# Altium schematic sheet Sheet1.SchDoc
size A3
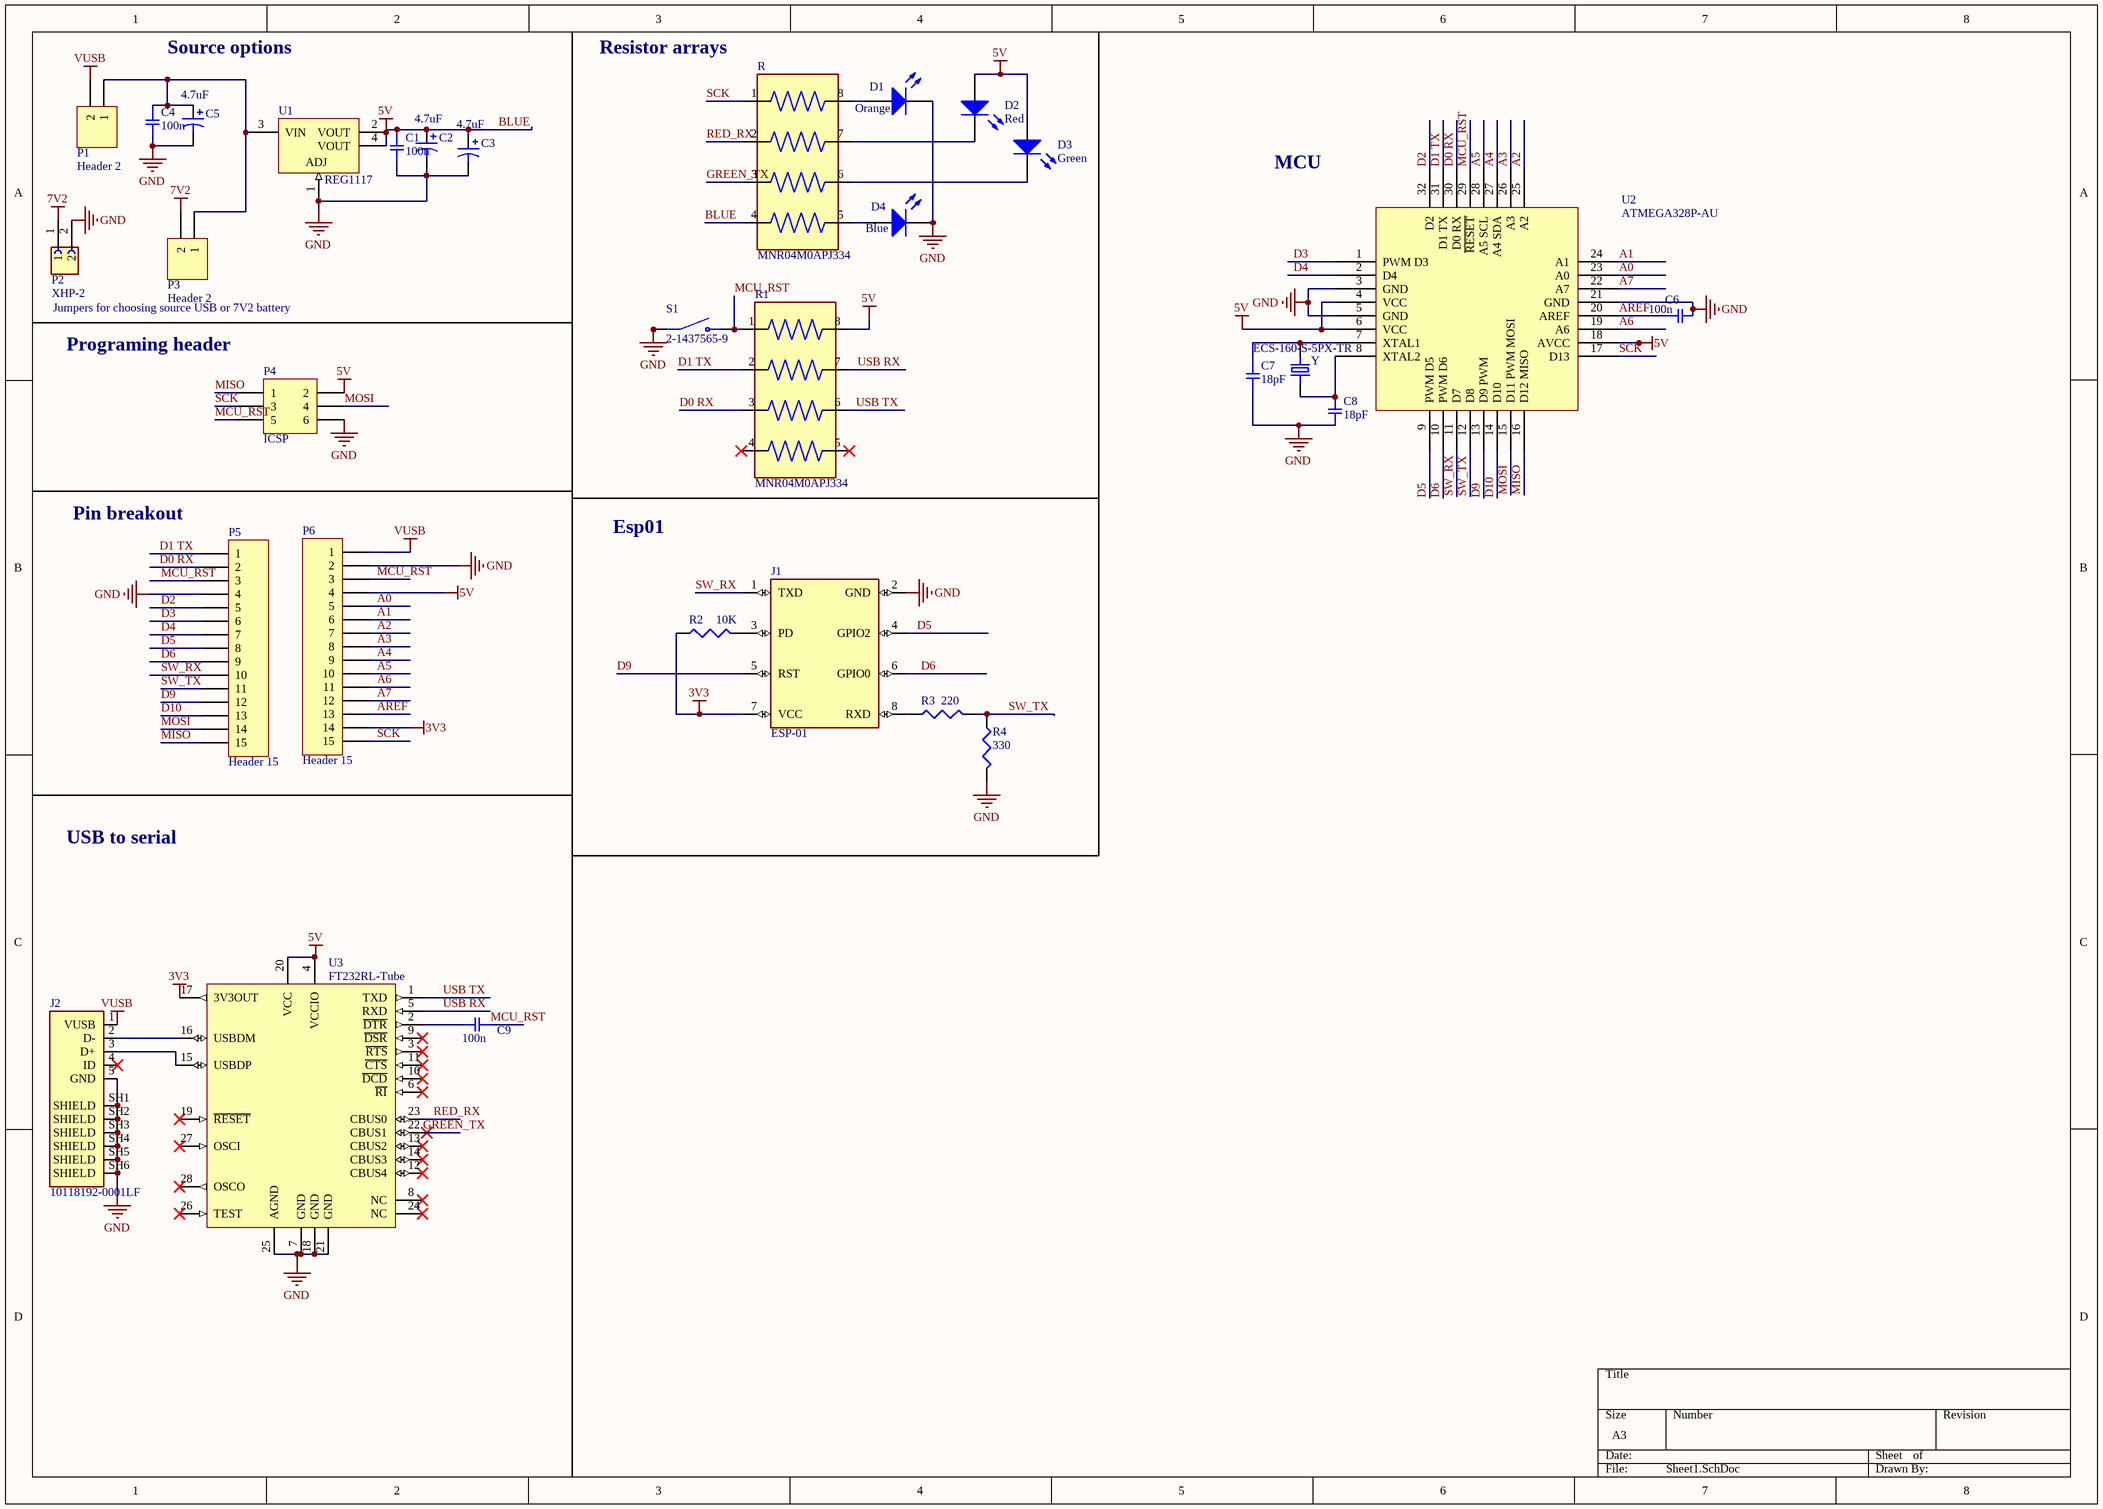
[diagram p0: Sheet1.SchDoc]

## Parts
C1  100n  [SMD-0805C]
C2  value 4.7uF  [49BC-E]  (hidden comment: 49BC475B010M)
C3  value 4.7uF  [49BC-E]  (hidden comment: 49BC475B010M)
C4  100n  [SMD-0805C]
C5  value 4.7uF  [49BC-E]  (hidden comment: 49BC475B010M)
C6  100n  [SMD-0805C]
C7  18pF  [SMD-0805C]
C8  18pF  [SMD-0805C]
C9  100n  [SMD-0805C]
D1  Orange  [2.0X1.25X0.8]
D2  Red  [2.0X1.25X0.8]
D3  Green  [2.0X1.25X0.8]
D4  Blue  [2.0X1.25X0.8]
J1  ESP-01  [ESP-01]
J2  10118192-0001LF  [AMPHENOL_10118192-0001LF]
P1  Header 2  [HDR1X2]
P2  XHP-2  [JST_XHP-2]
P3  Header 2  [HDR1X2]
P4  ICSP  [HDR2X3]
P5  Header 15  [HDR1X15]
P6  Header 15  [HDR1X15]
R  MNR04M0APJ334  [RESCAXS50P200X100X45-8N]
R1  MNR04M0APJ334  [RESCAXS50P200X100X45-8N]
R2  value 10K  [J1-0603]  (hidden comment: Res3)
R3  value 220  [J1-0603]  (hidden comment: Res3)
R4  value 330  [J1-0603]  (hidden comment: Res3)
S1  2-1437565-9  [SW_2-1437565-9]
U1  REG1117  [TI-DCY4_N]
U2  ATMEGA328P-AU  [TQFP80P900X900X120-32N]
U3  FT232RL-Tube  [SSOP-28_N]
Y  ECS-160-S-5PX-TR  [XTAL_ECS-160-S-5PX-TR]

## Nets
3V3: J1.7(VCC) P6.14 R2.1 U3.17(3V3OUT)
7V2: P2.1 P3.2
BLUE: C1.1 C2.1 C3.1 D2.1(A) D3.1(A) P4.2 P6.4 R.4 R1.8 U1.2(VOUT) U1.4(VOUT) U2.4(VCC) U2.6(VCC) U2.18(AVCC) U3.4(VCCIO) U3.20(VCC)  [also labelled 5V]
GND: C1.2 C2.2 C3.2 C4.2 C5.2 C6.2 C7.2 C8.2 D1.2(K) D4.2(K) J1.2(GND) J2.5(GND) J2.SH1(SHIELD) J2.SH2(SHIELD) J2.SH3(SHIELD) J2.SH4(SHIELD) J2.SH5(SHIELD) J2.SH6(SHIELD) P2.2 P4.6 P5.4 P6.2 R4.2 S1.1(COM) S1.2(COM) U1.1(ADJ) U2.3(GND) U2.5(GND) U2.21(GND) U3.7(GND) U3.18(GND) U3.21(GND) U3.25(AGND)
VUSB: J2.1(VUSB) P1.2 P6.1
A0: P6.5 U2.23(A0)
A1: P6.6 U2.24(A1)
A2: P6.7 U2.25(A2)
A3: P6.8 U2.26(A3)
A4: P6.9 U2.27(A4_SDA)
A5: P6.10 U2.28(A5_SCL)
A6: P6.11 U2.19(A6)
A7: P6.12 U2.22(A7)
AREF: C6.1 P6.13 U2.20(AREF)
D0 RX: P5.2 R1.3 U2.30(D0_RX)
D1 TX: P5.1 R1.2 U2.31(D1_TX)
D2: P5.5 U2.32(D2)
D3: P5.6 U2.1(PWM_D3)
D4: P5.7 U2.2(D4)
D5: J1.4(GPIO2) P5.8 U2.9(PWM_D5)
D6: J1.6(GPIO0) P5.9 U2.10(PWM_D6)
D9: J1.5(RST) P5.12 U2.13(D9_PWM)
D10: P5.13 U2.14(D10)
GREEN_TX: R.3 U3.22(CBUS1)
MCU_RST: C9.2 P4.5 P5.3 P6.3 R1.1 S1.3(NO) S1.4(NO) U2.29(~{RESET})
MISO: P4.1 P5.15 U2.16(D12_MISO)
MOSI: P4.4 P5.14 U2.15(D11_PWM_MOSI)
RED_RX: R.2 U3.23(CBUS0)
SCK: P4.3 P6.15 R.1 U2.17(D13)
SW_RX: J1.1(TXD) P5.10 U2.11(D7)
SW_TX: P5.11 R3.2 R4.1 U2.12(D8)
USB RX: R1.7 U3.5(RXD)
USB TX: R1.6 U3.1(TXD)
NetC4_1: C4.1 C5.1 P1.1 P3.1 U1.3(VIN)
NetC7_1: C7.1 U2.7(XTAL1) Y.2
NetC8_1: C8.1 U2.8(XTAL2) Y.1
NetC9_1: C9.1 U3.2(~{DTR})
NetD1_1: D1.1(A) R.8
NetD2_2: D2.2(K) R.7
NetD3_2: D3.2(K) R.6
NetD4_1: D4.1(A) R.5
NetJ1_3: J1.3(PD) R2.2
NetJ1_8: J1.8(RXD) R3.1
NetJ2_2: J2.2(D-) U3.16(USBDM)
NetJ2_3: J2.3(D+) U3.15(USBDP)

Not connected (* = marked no-connect by the designer): J2 4(ID)*; R1 4* 5*; U3 3(~{RTS})* 6(~{RI})* 8(NC)* 9(~{DSR})* 10(~{DCD})* 11(~{CTS})* 12(CBUS4)* 13(CBUS2)* 14(CBUS3)* 19(~{RESET})* 24(NC)* 26(TEST)* 27(OSCI)* 28(OSCO)*

## Notes on the sheet
- Source options
- (near R) Resistor arrays
- MCU
- Jumpers for choosing source USB or 7V2 battery
- (near P4) Programing header
- (near P5) Pin breakout
- Esp01
- USB to serial

## Library data of the parts
C1 C4 C6-C9 = GQM2195C2A180JB01D: CAP CER 18PF 100V NP0 0805; Manufacturer: Murata Electronics North America; Factory Stock: 0; Unit Price (USD): 0.91; Minimum Quantity: 1; Tolerance: ±5%; Voltage: 50V; Temperature Coefficient: C0G, NP0; Datasheets: http://www.murata.com/~/media/webrenewal/support/library/catalog/products/capacitor/mlcc/c02e.pdf; Image: //media.digikey.com/Renders/Murata%20Renders/0805(GxM9).jpg; Digi-Key Part Number: 490-3606-1-ND; Part Number: GQM2195C2A180JB01D; Quantity Available: 8724; @ qty: 0; Packaging: Cut Tape (CT); Series: GQM; Part Status: Active; Operating Temperature: -55°C ~ 125°C; Features: High Q, Low Loss; Ratings: -; Applications: RF, Microwave, High Frequency; Mounting Type: Surface Mount, MLCC; Package / Case: 0805 (2012 Metric); Size / Dimension: 0.079" L x 0.049" W (2.00mm x 1.25mm); Height - Seated (Max): -; Thickness (Max): 0.037" (0.95mm); Lead Spacing: -; Lead Style: -
  C1 C4 C6 C9: Value: 100n
  C7 C8: Value: 18pF
C2 C3 C5 = 49BC475B010M: Conformal Coated Solid Tantalum Chip Capacitor: 4.7uF, 20% Tolerance, 10 WVDC @ -55°C to +85°C, Surge = 13V; Note: See Data Sheet for full range of components; Published: 19-Mar-2004; DatasheetDocument: 05-Jul-2002; PackageReference: 49BC-E; Publisher: Altium Limited; ComponentLink1Description: Manufacturer Link; ComponentLink1URL: http://www.vishay.com/
D1 = HSMQ-C170: LuminousIntensity: 40mcd (Minimum).; LED_Colour: Green; PCB_Layout: Complies with manufacturer's recommendation.; Published: 11-Dec-2002; DatasheetVersion: 6-Apr-2002; PackageVersion: Oct-2001; PackageReference: 2.0X1.25X0.8; Publisher: Altium Limited; PackageDescription: SM LED; 2 Flat Leads; ComponentLink1Description: Manufacturer Link; ComponentLink1URL: http://www.avagotech.com/; ComponentLink2Description: Datasheet; ComponentLink2URL: http://cp.literature.agilent.com/litweb/pdf/5988-4832EN.pdf
D2-D4 = HSMQ-C170: SMT Top Mount Chip LED, Green; LuminousIntensity: 40mcd (Minimum).; PCB_Layout: Complies with manufacturer's recommendation.; Published: 11-Dec-2002; DatasheetVersion: 6-Apr-2002; PackageVersion: Oct-2001; PackageReference: 2.0X1.25X0.8; Publisher: Altium Limited; PackageDescription: SM LED; 2 Flat Leads; LED_Colour: Green; ComponentLink1Description: Manufacturer Link; ComponentLink1URL: http://www.avagotech.com/; ComponentLink2Description: Datasheet; ComponentLink2URL: http://cp.literature.agilent.com/litweb/pdf/5988-4832EN.pdf
J1 = ESP-01: ESP-01M ESP8266 DIP Adapter series Transceiver; 802.11 b/g/n (Wi-Fi, WiFi, WLAN) Evaluation Board; MF: AI-Thinker; Price: None; Availability: Not in stock; Package: Non-Standard AI-Thinker; MP: ESP-01; Value: *; SnapEDA_Link: https://www.snapeda.com/parts/ESP-01/AI-Thinker/view-part/?ref=snap; Check_prices: https://www.snapeda.com/parts/ESP-01/AI-Thinker/view-part/?ref=eda
J2 = 10118192-0001LF: Micro USB, Input Output Connectors, B TYPE RECEPTACLE with flange; MF: AMPHENOL ICC / FCI; Check_prices: https://www.snapeda.com/parts/10118192-0001LF/Amphenol/view-part/?ref=eda; Value: *; SnapEDA_Link: https://www.snapeda.com/parts/10118192-0001LF/Amphenol/view-part/?ref=snap; Price: None; Availability: In Stock; Package: None; MP: 10118192-0001LF
P1 P3 = Header 2: Header, 2-Pin; LatestRevisionDate: 17-Jul-2002; LatestRevisionNote: Re-released for DXP Platform.; Publisher: Altium Limited
P2 = XHP-2: XH Series 2 Position 2.5 mm Pitch Wire-to-Board Housing Connector; Availability: Unavailable; Package: None; MP: XHP-2; Value: *; Price: None
P4 = Header 3X2: Header, 3-Pin, Dual row; LatestRevisionDate: 17-Jul-2002; LatestRevisionNote: Re-released for DXP Platform.; Publisher: Altium Limited
P5 P6 = Header 15: Header, 15-Pin; LatestRevisionDate: 17-Jul-2002; LatestRevisionNote: Re-released for DXP Platform.; Publisher: Altium Limited
R R1 = MNR04M0APJ334: Res Array 330K Ohm 5% Â±200ppm/Â°C ISOL Epoxy 8-Pin 0804(4 X 0402) Convex SMD Automotive T/R; MF: Rohm; Price: None; SnapEDA_Link: https://www.snapeda.com/parts/MNR04M0APJ334/Rohm/view-part/472925/?ref=snap; MP: MNR04M0APJ334; Availability: Unavailable; Value: *; Package: 0402 Rohm
R2-R4 = Res3: Resistor; Published: 8-Jun-2000; LatestRevisionDate: 29-May-2009; LatestRevisionNote: IPC-7351 Footprint Added.; PackageReference: J1-0603; Publisher: Altium Limited; PackageDescription: Chip Resistor
S1 = 2-1437565-9: MF: {'manufacturer': 'TE Connectivity'}; Value: *; MP: 2-1437565-9; Availability: Unavailable; Price: None; Package: None
U1 = REG1117: Single Output LDO, 800 mA, Adjustable 1.5 to 13.5 V Output, 3.8 to 15 V Input, with Internal Current Limiting, 4-pin SOT-223 (DCY), -40 to 125 degC, Green (RoHS & no Sb/Br); Manufacturer: Texas Instruments; Iout(Max)(A): 0.8; Iq(Typ)(mA): 4; Rating: Catalog; SubFamily: Single Channel LDO; Vdo(Typ)(mV): 1100; Vin(Max)(V): 15; Vin(Min)(V): 3.8; Vout Adj(Max)(V): 13.5; Vout Adj(Min)(V): 1.25; DatasheetVersion: SBVS001D; PackageVersion: 4202506/B; PackageReference: DCY4; PackageDescription: 4-Pin Plastic Small Outline, Body 3.5 x 6.5 mm, Pitch 2.3 mm; Supplier 1: Digi-Key; Supplier Part Number 1: REG1117-ND; Supplier 2: Farnell; Supplier Part Number 2: 1097566; Supplier 3: Newark; Supplier Part Number 3: 14P6981; Supplier 4: Mouser; Supplier Part Number 4: 595-REG1117; Eco-Plan: Green (RoHS & no Sb/Br); Mounting Technology: Surface Mount; Code_JEDEC: TO-261; PartNumber: REG1117; ComponentLink1Description: Manufacturer URL; ComponentLink1URL: http://www.ti.com/; ComponentLink2Description: Datasheet; ComponentLink2URL: http://www.ti.com/general/docs/lit/getliterature.tsp?genericPartNumber=REG1117&fileType=pdf; ComponentLink3Description: Package Specification; ComponentLink3URL: http://www.ti.com/litv/pdf/mpds094a
U2 = ATMEGA328P-AU: Microchip ATMEGA328P-AU, 8bit AVR Microcontroller, ATmega, 20MHz, 32 kB Flash, 32-Pin TQFP; GigiKey Stock N°: 2156-ATMEGA328P-AU-ND; Created by: Mariano Franceschetti; Date created: 05-03-2023; Datasheet URL: https://ww1.microchip.com/downloads/en/DeviceDoc/Atmel-7810-Automotive-Microcontrollers-ATmega328P_Datasheet.pdf
U3 = FT232RL-Tube: USB UART Asynchronous Serial Data Transfer Chip, SSOP-28, Tube; Published: 19-Aug-2010; DatasheetVersion: ver 2.07, Jul-2010; PackageVersion: 2010; PackageReference: SSOP-28; Publisher: Altium Limited; PackageDescription: 28-Pin Small Outline Package 0.65 mm Pitch; ComponentLink1Description: Manufacturer Link; ComponentLink1URL: http://www.ftdichip.com/Products/ICs/FT232R.htm; ComponentLink2Description: Datasheet; ComponentLink2URL: http://www.ftdichip.com/Support/Documents/DataSheets/ICs/DS_FT232R.pdf
Y = ECS-160-S-5PX-TR: 16MHz Â±30ppm Crystal Series 40 Ohms HC-49/US; MF: ECS Inc.; MP: ECS-160-S-5PX-TR; Package: HC49/US ECS International; Price: None; Availability: Unavailable; Value: *; SnapEDA_Link: https://www.snapeda.com/parts/ECS-160-S-5PX-TR/ECS%20Inc./view-part/2457269/?ref=snap